# EAGLE design NextOne (EAGLE 7.3.0)
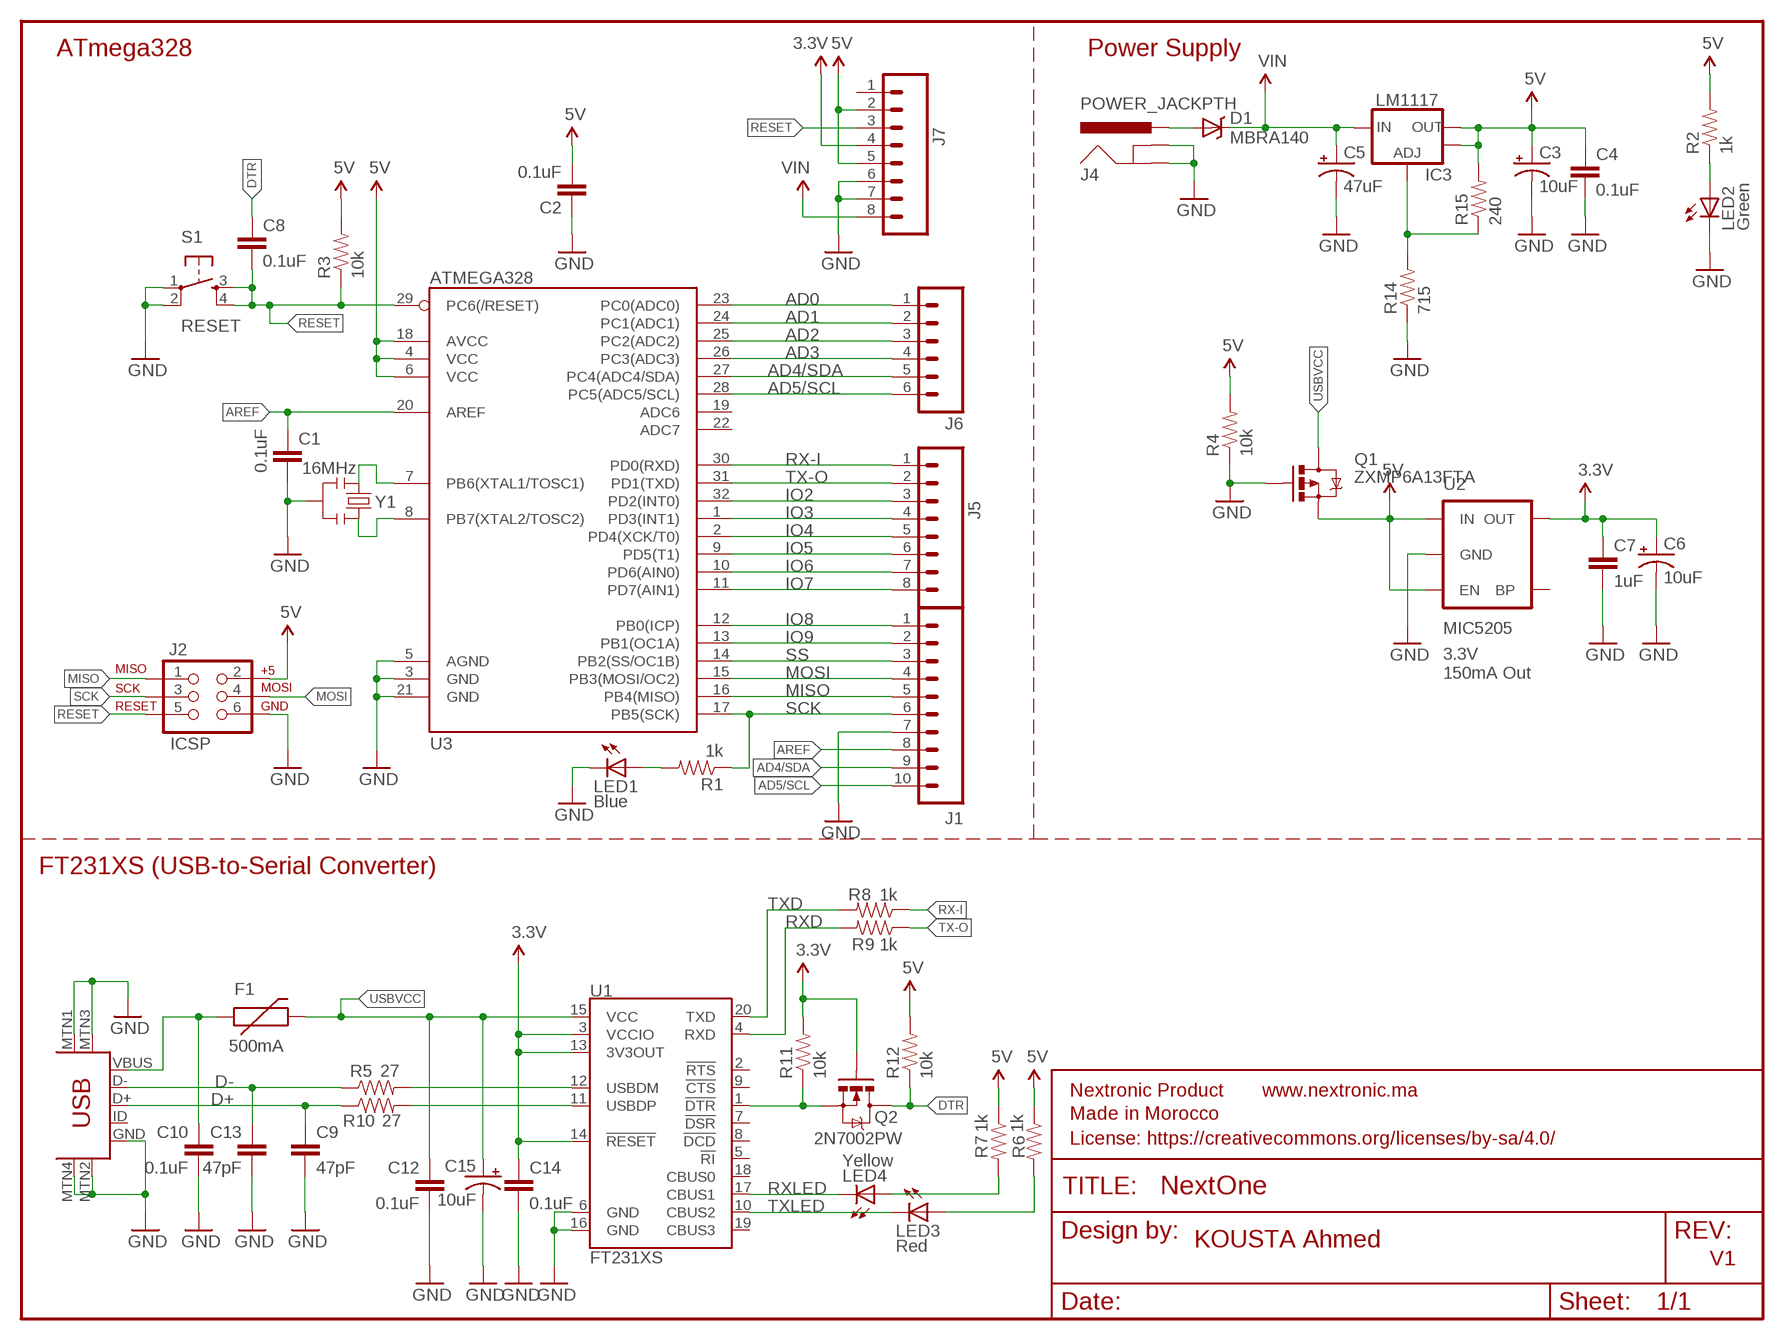
[diagram p0: schematic, sheet 1]

## Parts
C1  0.1uF  CAP0603-CAP  [0603-CAP]
C2  0.1uF  CAP0603-CAP  [0603-CAP]
C3  10uF  CAP_POL1206  [EIA3216]
C4  0.1uF  CAP0603-CAP  [0603-CAP]
C5  47uF  CAP_POLD  [PANASONIC_D]
C6  10uF  CAP_POL1206  [EIA3216]
C7  1uF  CAP0603-CAP  [0603-CAP]
C8  0.1uF  CAP0603-CAP  [0603-CAP]
C9  47pF  47PF-50V-5%(0603)  [0603-CAP]
C10  0.1uF  CAP0603-CAP  [0603-CAP]
C12  0.1uF  CAP0603-CAP  [0603-CAP]
C13  47pF  47PF-50V-5%(0603)  [0603-CAP]
C14  0.1uF  CAP0603-CAP  [0603-CAP]
C15  10uF  CAP_POL1206  [EIA3216]
D1  MBRA140  DIODE-SCHOTTKY_  [SMA-DIODE]
F1  500mA  PTCSMD  [PTC-1206]
FRAME1  FRAME-LETTER  [CREATIVE_COMMONS]
IC3  LM1117  V_REG_LM1117ALT1  [SOT223-ALT1]
J1  M10SILK_FEMALE_PTH  [1X10]
J2  ICSP  AVR_SPI_PRG_6PTH  [2X3]
J4  POWER_JACKPTH  [POWER_JACK_PTH]
J5  M08  [1X08_ROUND]
J6  M06SILK_FEMALE_PTH  [1X06]
J7  M08  [1X08_ROUND]
LED1  Blue  LED1206-NS  [LED-1206-NO_SILK]
LED2  Green  LED1206-NS  [LED-1206-NO_SILK]
LED3  Red  LED1206-NS  [LED-1206-NO_SILK]
LED4  Yellow  LED1206-NS  [LED-1206-NO_SILK]
Q1  ZXMP6A13FTA  MOSFET-PCHANNELSMD  [SOT23-3]
Q2  2N7002PW  MOSFET-NCHANNEL2N7002PW  [SOT323]
R1  1k  RESISTOR0603-RES  [0603-RES]
R2  1k  RESISTOR0603-RES  [0603-RES]
R3  10k  RESISTOR0603-RES  [0603-RES]
R4  10k  RESISTOR0603-RES  [0603-RES]
R5  27  RESISTOR0603-RES  [0603-RES]
R6  1k  RESISTOR0603-RES  [0603-RES]
R7  1k  RESISTOR0603-RES  [0603-RES]
R8  1k  RESISTOR0603-RES  [0603-RES]
R9  1k  RESISTOR0603-RES  [0603-RES]
R10  27  RESISTOR0603-RES  [0603-RES]
R11  10k  RESISTOR0603-RES  [0603-RES]
R12  10k  RESISTOR0603-RES  [0603-RES]
R14  715  RESISTOR0603-RES  [0603-RES]
R15  240  RESISTOR0603-RES  [0603-RES]
S1  RESET  TAC_SWITCHSMD  [TACTILE_SWITCH_SMD]
U1  FT231XS  [SSOP20_L]
U2  MIC5205  V_REG_LDOSMD  [SOT23-5]
U3  ATMEGA328  ATMEGA168  [TQFP32-08]
U$13  USB-MINIB-5PIN  [USB-MINIB]
Y1  16MHz  RESONATORSMD  [RESONATOR-SMD]

## Nets
3.3V: C6.A(+) C7.1 C14.1 J7.4 Q2.1(G) R11.2 U1.3(VCCIO) U1.13(3V3OUT) U1.14(!RESET) U2.5(OUT)
5V: C2.2 C3.A(+) C4.1 IC3.2(OUT) IC3.4(OUT) J2.2 J7.2 J7.5 Q1.2(S) R2.2 R3.2 R4.2 R6.1 R7.1 R12.2 R15.2 U2.1(IN) U2.3(EN) U3.4(VCC) U3.6(VCC) U3.18(AVCC)
AD0: J6.1 U3.23(PC0(ADC0))
AD1: J6.2 U3.24(PC1(ADC1))
AD2: J6.3 U3.25(PC2(ADC2))
AD3: J6.4 U3.26(PC3(ADC3))
AD4/SDA: J1.9 J6.5 U3.27(PC4(ADC4/SDA))
AD5/SCL: J1.10 J6.6 U3.28(PC5(ADC5/SCL))
AREF: C1.1 J1.8 U3.20(AREF)
D+: C9.1 R10.1 U$13.D+
D-: C13.1 R5.1 U$13.D-
DTR: C8.1 Q2.3(D) R12.1
GND: C1.2 C2.1 C3.C(-) C4.2 C5.- C6.C(-) C7.2 C9.2 C10.2 C12.2 C13.2 C14.2 C15.C(-) J1.7 J2.6 J4.GND J4.GNDBREAK J7.6 J7.7 LED1.C LED2.C Q1.1(G) R4.1 R14.1 S1.1 S1.2 U1.6(GND) U1.16(GND) U2.2(GND) U3.3(GND) U3.5(AGND) U3.21(GND) U$13.GND U$13.MTN1(MTN2) U$13.MTN2(MTN3) U$13.MTN3(MTN1) U$13.MTN4 Y1.2
IO2: J5.3 U3.32(PD2(INT0))
IO3: J5.4 U3.1(PD3(INT1))
IO4: J5.5 U3.2(PD4(XCK/T0))
IO5: J5.6 U3.9(PD5(T1))
IO6: J5.7 U3.10(PD6(AIN0))
IO7: J5.8 U3.11(PD7(AIN1))
IO8: J1.1 U3.12(PB0(ICP))
IO9: J1.2 U3.13(PB1(OC1A))
MISO: J1.5 J2.1 U3.16(PB4(MISO))
MOSI: J1.4 J2.4 U3.15(PB3(MOSI/OC2))
N$1: LED1.A R1.2
N$2: LED2.A R2.1
N$3: U3.7(PB6(XTAL1/TOSC1)) Y1.1
N$4: U3.8(PB7(XTAL2/TOSC2)) Y1.3
N$5: D1.A J4.PWR
N$6: R5.2 U1.12(USBDM)
N$7: R10.2 U1.11(USBDP)
N$8: LED3.A R6.2
N$10: LED4.A R7.2
N$12: Q2.2(S) R11.1 U1.1(!DTR)
N$15: IC3.1(ADJ) R14.2 R15.1
RESET: C8.2 J2.5 J7.3 R3.1 S1.3 S1.4 U3.29(PC6(/RESET))
RX-I: J5.1 R8.1 U3.30(PD0(RXD))
RXD: R9.2 U1.4(RXD)
RXLED: LED4.C U1.17(CBUS1)
SCK: J1.6 J2.3 R1.1 U3.17(PB5(SCK))
SS: J1.3 U3.14(PB2(SS/OC1B))
TX-O: J5.2 R9.1 U3.31(PD1(TXD))
TXD: R8.2 U1.20(TXD)
TXLED: LED3.C U1.10(CBUS2)
USBVCC: C12.1 C15.A(+) F1.2 Q1.3(D) U1.15(VCC)
VIN: C5.+ D1.C IC3.3(IN) J7.8
VUSB: C10.1 F1.1 U$13.VBUS
Unconnected: J7.1 U1.2(!RTS) U1.5(!RI) U1.7(!DSR) U1.8(!DCD) U1.9(!CTS) U1.18(CBUS0) U1.19(CBUS3) U2.4(BP) U3.19(ADC6) U3.22(ADC7) U$13.ID

## Notes on the sheet
- ATmega328 | Power Supply
- 3.3V
  150mA Out
- FT231XS (USB-to-Serial Converter)
- KOUSTA Ahmed
- V1

## Library data of the parts
C1 C2 C4 C8 C10 C12 C14 = SparkFun:CAP: Capacitor Standard 0603 ceramic capacitor, and 0.1" leaded capacitor.; OC_FARNELL: unknown
C3 C6 = SparkFun:CAP_POL: Capacitor Polarized These are standard SMD and PTH capacitors. Normally 10uF, 47uF, and 100uF in electrolytic and tantalum varieties. Always verify the external diameter of the through hole cap, it varies with capacity, voltage, and manufacturer. The EIA devices should be standard.; OC_FARNELL: unknown
C5 = SparkFun:CAP_POL: Capacitor Polarized These are standard SMD and PTH capacitors. Normally 10uF, 47uF, and 100uF in electrolytic and tantalum varieties. Always verify the external diameter of the through hole cap, it varies with capacity, voltage, and manufacturer. The EIA devices should be standard.; MF: PANASONIC ELECTRONIC COMPONENTS; MPN: EEE1CA470SP; OC_FARNELL: 9696946
C7 = SparkFun:CAP: Capacitor Standard 0603 ceramic capacitor, and 0.1" leaded capacitor.; MF: WALSIN; MPN: 0805B104K500CT; OC_FARNELL: 2496944
C9 C13 = SparkFun-Capacitors:47PF-50V-5%(0603): CAP-08913; MF: AVX; MPN: 12061A470JAT2A; OC_FARNELL: 499262; PROD_ID: CAP-08913
C15 = SparkFun-Capacitors:CAP_POL: Capacitor Polarized These are standard SMD and PTH capacitors. Normally 10uF, 47uF, and 100uF in electrolytic and tantalum varieties. Always verify the external diameter of the through hole cap, it varies with capacity, voltage, and manufacturer. The EIA devices should be standard.; OC_FARNELL: unknown
D1 = SparkFun:DIODE-SCHOTTKY; MF: DIODES INC.; MPN: B140-13-F; OC_FARNELL: 1843670
F1 = SparkFun:PTC: Resettable Fuse PTC Resettable Fuse. Spark Fun Electronics SKU : COM-08357; MF: FAIRCHILD SEMICONDUCTOR; MPN: 1N3070TR; OC_FARNELL: 1700871
FRAME1 = SparkFun-Aesthetics:FRAME-LETTER: Schematic Frame Standard 8.5x11 US Letter frame; OC_FARNELL: unknown
IC3 = Testing:V_REG_LM1117: Voltage Regulator LM1117 Standard adjustable voltage regulator but in SMD form. Spark Fun Electronics SKU : COM-00595; MF: STMICROELECTRONICS; MPN: LD1117S33TR; OC_FARNELL: 1202826
J1 = SparkFun-Connectors:M10: Header 10 Standard 10-pin 0.1" header. Use with straight break away headers (SKU : PRT-00116), right angle break away headers (PRT-00553), swiss pins (PRT-00743), machine pins (PRT-00117), and female headers (PRT-00115).; OC_FARNELL: unknown; PROD_ID: CONN-11563
J2 = SparkFun-Connectors:AVR_SPI_PRG_6: AVR ISP 6 Pin This is the reduced ISP connector for AVR programming. Common on Arduino. This footprint will take up less PCB space and can be used with a 10-pin to 6-pin adapter such as SKU: BOB-08508 **Special note about "TEST_POINT" package. The stop mask is on the top side, so if you want your programming test points to be on the bottom of your board, make sure to place this package on the bottom side of the board. This also ensure that the orientation to program from the bottom side will be correct.; OC_FARNELL: unknown
J4 = SparkFun-Connectors:POWER_JACK: Power Jack This is the standard 5.5mm barrel jack for power. The PTH is the most common, proven, reliable, footprint. The Slot footprint only works if the mill layer is transmitted to the PCB fab house so be warned. Mating wall wart : TOL-00298 (and others); OC_FARNELL: unknown; PROD_ID: CONN-08197
J5 J7 = SparkFun-Connectors:M08: Header 8 Standard 8-pin 0.1" header. Use with straight break away headers (SKU : PRT-00116), right angle break away headers (PRT-00553), swiss pins (PRT-00743), machine pins (PRT-00117), and female headers (PRT-00115).; OC_FARNELL: unknown; PROD_ID: CONN-08437
J6 = SparkFun-Connectors:M06: Header 6 Standard 6-pin 0.1" header. Use with straight break away headers (SKU : PRT-00116), right angle break away headers (PRT-00553), swiss pins (PRT-00743), machine pins (PRT-00117), and female headers (PRT-00115). Molex polarized connector foot print use with SKU : PRT-08094 with associated crimp pins and housings. NOTES ON THE VARIANTS LOCK and LOCK_LONGPADS... This footprint was designed to help hold the alignment of a through-hole component (i.e. 6-pin header) while soldering it into place. You may notice that each hole has been shifted either up or down by 0.005 of an inch from it's more standard position (which is a perfectly straight line). This slight alteration caused the pins (the squares in the middle) to touch the edges of the holes. Because they are alternating, it causes a "brace" to hold the component in place. 0.005 has proven to be the perfect amount of "off-center" position when using our standard breakaway headers. Although looks a little odd when you look at the bare footprint, once you have a header in there, the alteration is very hard to notice. Also,if you push a header all the way into place, it is covered up entirely on the bottom side. This idea of altering the position of holes to aid alignment will be further integrated into the Sparkfun Library for other footprints. It can help hold any component with 3 or more connection pins.; OC_FARNELL: unknown; PROD_ID: CONN-08437
LED1-LED4 = SparkFun-LED:LED: LEDs Standard schematic elements and footprints for 5mm, 3mm, 1206, and 0603 sized LEDs. 5mm - Spark Fun Electronics SKU : COM-00529 (and others); OC_FARNELL: unknown
Q1 = SparkFun:MOSFET-PCHANNEL; MF: DIODES INC.; MPN: ZXMP6A13FTA; OC_FARNELL: 1843770RL
Q2 = SparkFun-DiscreteSemi:MOSFET-NCHANNEL: Common NMOSFET Parts MFG P/N Store ID Prod ID FDD8780 TRANS-09984 SI7820DN TRANS-11055 FDS6630A IC-08089 2N7002PW TRANS-11151 FQP30N06L COM-10213 TRANS-10060 BSS123LT1G TRANS-08345 BSS138 TRANS-00830 BS170 2N7000; OC_FARNELL: unknown; PROD_ID: TRANS-11151
R1-R4 R6-R9 R11 R12 R14 R15 = SparkFun:RESISTOR: Resistor Basic schematic elements and footprints for 0603, 1206, and PTH resistors.; OC_FARNELL: unknown
R5 R10 = SparkFun-Resistors:RESISTOR: Resistor Basic schematic elements and footprints for 0603, 1206, and PTH resistors.; OC_FARNELL: unknown
S1 = SparkFun:TAC_SWITCH: Momentary Switch Button commonly used for reset or general input. Spark Fun Electronics SKU : COM-00097; OC_FARNELL: unknown
U1 = SparkFun-DigitalIC:FT231X: FTDI FT231X Full Speed USB to Full-handshake UART This USB2.0 Full Speed IC offers a compact bridge to full handshake UART interfaces. The device is a UART, capable of operating up to 3MBaud, with low power consumption (8mA). The FT231X includes the complete FT-X series feature set and enables USB to be added into a system design quickly and easily over a UART interface.; MF: FTDI; MPN: FT231XS; OC_FARNELL: 2081328
U2 = SparkFun:V_REG_LDO: Voltage Regulator LDO Standard 150mA LDO voltage regulator in SOT-23 layout. Micrel part MIC5205. BP (by-pass) pin is used to lower output noise with 470pF cap.; OC_FARNELL: unknown
U3 = SparkFun:ATMEGA168; MF: ATMEL; MPN: ATMEGA328P-AN; OC_FARNELL: 2443178
U$13 = SparkFun-Connectors:USB-MINIB: Mini-USB "B" connector with 5th pin broken out. Created new symbol breaking out 5th "ID" pin in mini/micro USB connector spec. See: http://en.wikipedia.org/wiki/Mini_usb#Cables. Uses same footprint as 4-pin symbol. Also added pins to connect to mounting / shield pads if required (probably not generally needed as signals aren't shielded once they leave the connector).; MF: TE CONNECTIVITY / AMP; MPN: 1734035-1.; OC_FARNELL: 1654060
Y1 = SparkFun-FreqCtrl:RESONATOR: Resonator Small SMD resonator. This is the itty bitty 10/20MHz resonators with built in caps. CSTCE10M0G55 and CSTCE20M0V53. Footprint has been reviewed closely but hasn't been tested yet.; OC_FARNELL: unknown

## Net classes
0 default: width 0.152 mm, drill 0.305 mm, clearance 0.152 mm

## Board
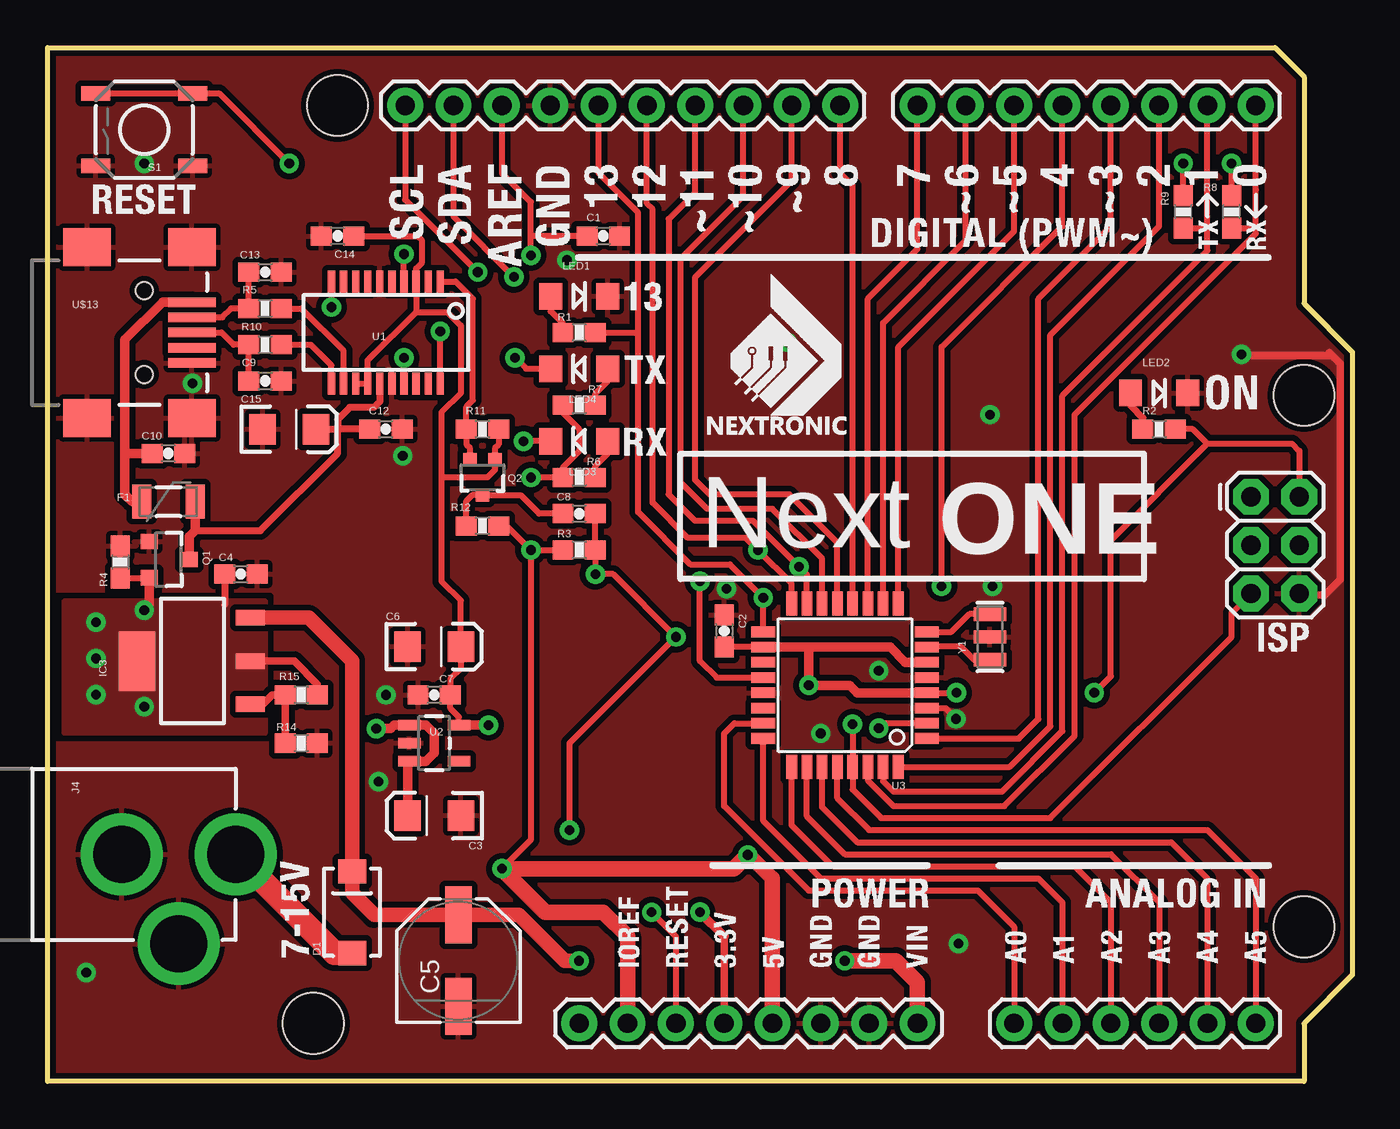
[diagram p1: board, top side]
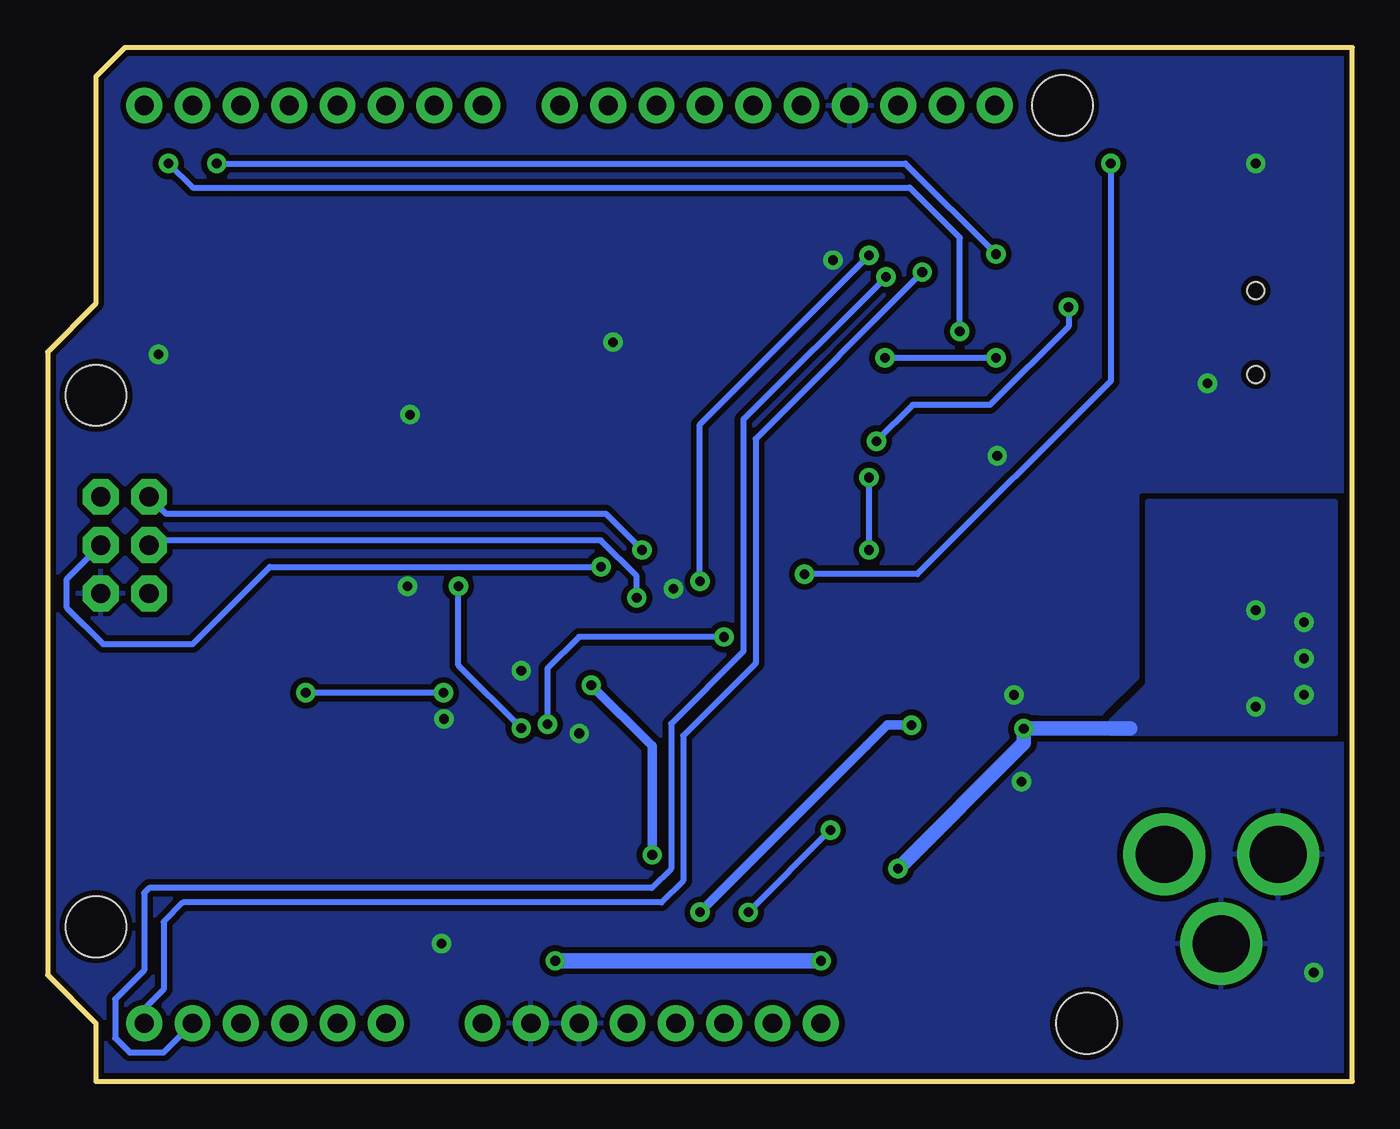
[diagram p2: board, bottom side, seen from below]

Size 68.58 x 54.36 mm. Coordinates in mm from the lower left corner, seen from the top.
Outline: 0,54.36 64.52,54.36 66.04,52.83 66.04,40.89 68.58,38.35 68.58,5.59 66.04,3.05 66.04,0 0,0 0,54.36
Copper layers (1*16): Top 0.035mm / dielectric 1.5mm / Bottom 0.035mm
Design rules "SparkFun-2-layer": minimum track width 7mil, minimum drill 15mil, track to track 8mil, track to pad 8mil, pad to pad 8mil, via to via 8mil, smd to smd 8mil, copper to edge 8mil, drill to drill 8mil, minimum pad ring 12mil, minimum via ring 10mil, stop-mask expansion 4mil, vias tented up to drill 20mil, thermal gap 10mil
Holes 3.2 mm at 13.97,3.05 66.04,8.13 66.04,36.07 15.24,51.31
vRestrict: area 0.6,22.4 to 2,30.6; area 5.7,23.1 to 7.4,30.6; area 47.9,10.8 to 48.5,11.3; area 50.4,10.7 to 50.9,11.6; area 11.3,29.3 to 12.7,31.6; area 0.3,13 to 9.4,25

### Footprints (pad centres in the part's own frame; a part is rotated, then mirrored left to right if it is on the bottom)
0603-CAP = smd 1.1 x 1: 1 -0.85,0; 2 0.85,0
EIA3216 = smd 1.4 x 1.6: A 1.4,0; C -1.4,0
PANASONIC_D = smd 3 x 1.4: + 2.4,0; - -2.4,0
SMA-DIODE = smd 1.27 x 1.47: A -2.15,0; C 2.15,0
PTC-1206 = smd 1 x 1.8: 1 -1.4,0; 2 1.4,0
SOT223-ALT1 = smd 0.813 x 1.524: 1 -2.271,-3.02; 2 0,-3.02; 3 2.288,-3.02 | smd 3.124 x 1.905: 4 0,2.921
1X10 = drill 1.016 pad 1.88: 1 0,0; 2 2.54,0; 3 5.08,0; 4 7.62,0; 5 10.16,0; 6 12.7,0; 7 15.24,0; 8 17.78,0; 9 20.32,0; 10 22.86,0
2X3 = drill 1.016 pad 1.88 octagon: 1 0,0; 2 0,2.54; 3 2.54,0; 4 2.54,2.54; 5 5.08,0; 6 5.08,2.54
POWER_JACK_PTH = drill 2.997 pad 4.318: GND 0,7.7; GNDBREAK 4.7,10.7; PWR 0,13.7
1X08_ROUND = drill 1.016 pad 1.88: 1 0,0; 2 2.54,0; 3 5.08,0; 4 7.62,0; 5 10.16,0; 6 12.7,0; 7 15.24,0; 8 17.78,0
1X06 = drill 1.016 pad 1.88: 1 0,0; 2 2.54,0; 3 5.08,0; 4 7.62,0; 5 10.16,0; 6 12.7,0
LED-1206-NO_SILK = smd 1.2 x 1.4: A -1.5,0; C 1.5,0
SOT23-3 = smd 0.8 x 0.9: 1 -0.95,-1; 2 0.95,-1; 3 0,1.1
SOT323 = smd 0.7 x 0.7: 1 -0.65,-0.925; 2 0.65,-0.925; 3 0,0.925
0603-RES = smd 1.1 x 1: 1 -0.85,0; 2 0.85,0
TACTILE_SWITCH_SMD = smd 1.524 x 0.762: 1 -2.54,1.905; 2 2.54,1.905; 3 -2.54,-1.905; 4 2.54,-1.905
SSOP20_L = smd 0.381 x 1.143: 1 -2.857,-2.68; 2 -2.223,-2.68; 3 -1.587,-2.68; 4 -0.953,-2.68; 5 -0.318,-2.68; 6 0.318,-2.68; 7 0.953,-2.68; 8 1.587,-2.68; 9 2.223,-2.68; 10 2.857,-2.68; 11 2.857,2.68; 12 2.223,2.68; 13 1.587,2.68; 14 0.953,2.68; 15 0.318,2.68; 16 -0.318,2.68; 17 -0.953,2.68; 18 -1.587,2.68; 19 -2.223,2.68; 20 -2.857,2.68
SOT23-5 = smd 0.55 x 1.2: 1 -0.95,-1.3; 2 0,-1.3; 3 0.95,-1.3; 4 0.95,1.3; 5 -0.95,1.3
TQFP32-08 = smd 1.27 x 0.559: 1 -4.293,2.8; 2 -4.293,2; 3 -4.293,1.2; 4 -4.293,0.4; 5 -4.293,-0.4; 6 -4.293,-1.2; 7 -4.293,-2; 8 -4.293,-2.8; 17 4.293,-2.8; 18 4.293,-2; 19 4.293,-1.2; 20 4.293,-0.4; 21 4.293,0.4; 22 4.293,1.2; 23 4.293,2; 24 4.293,2.8 | smd 0.559 x 1.27: 9 -2.8,-4.293; 10 -2,-4.293; 11 -1.2,-4.293; 12 -0.4,-4.293; 13 0.4,-4.293; 14 1.2,-4.293; 15 2,-4.293; 16 2.8,-4.293; 25 2.8,4.293; 26 2,4.293; 27 1.2,4.293; 28 0.4,4.293; 29 -0.4,4.293; 30 -1.2,4.293; 31 -2,4.293; 32 -2.8,4.293
USB-MINIB = smd 2.5 x 0.5: D+ 2.5,0; D- 2.5,0.8; GND 2.5,-1.6; ID 2.5,-0.8; VBUS 2.5,1.6 | smd 2.5 x 2: MTN1 -3,4.5; MTN2 2.5,4.5; MTN3 -3,-4.5; MTN4 2.5,-4.5 | hole 0.9: 0,2.2; 0,-2.2
RESONATOR-SMD = smd 0.7 x 1.7: 1 -1.2,0; 2 0,0; 3 1.2,0

### Placement (x,y rotation side)
C1  29.21,44.45 0 top
C2  35.56,23.68 270 top
C3  20.32,13.97 180 top
C4  10.16,26.67 0 top
C5  21.59,6.35 90 top
C6  20.32,22.86 0 top
C7  20.32,20.32 180 top
C8  27.94,29.84 0 top
C9  11.43,36.83 0 top
C10  6.35,33.02 0 top
C12  17.78,34.29 0 top
C13  11.43,42.55 0 top
C14  15.24,44.45 180 top
C15  12.7,34.29 0 top
D1  16,8.89 90 top
F1  6.35,30.48 0 top
FRAME1  -0.81,-0.94 0 top
IC3  7.62,22.1 90 top
J1  41.66,51.31 180 top
J2  63.25,30.73 270 top
J4  -3.81,11.94 270 top
J5  63.5,51.31 180 top
J6  50.8,3.05 0 top
J7  27.94,3.05 0 top
LED1  27.94,41.27 0 top
LED2  58.42,36.2 0 top
LED3  27.94,33.66 180 top
LED4  27.94,37.46 180 top
Q1  6.35,27.43 270 top
Q2  22.86,31.75 180 top
R1  27.94,39.37 180 top
R2  58.42,34.29 0 top
R3  27.94,27.94 180 top
R4  3.81,27.3 270 top
R5  11.43,40.64 0 top
R6  27.94,31.75 0 top
R7  27.94,35.56 0 top
R8  62.23,45.72 90 top
R9  59.69,45.72 90 top
R10  11.43,38.73 0 top
R11  22.86,34.29 0 top
R12  22.86,29.21 0 top
R14  13.33,17.78 180 top
R15  13.33,20.32 0 top
S1  5.08,50.04 180 top
U1  17.78,39.37 180 top
U2  20.32,17.78 270 top
U3  41.91,20.83 180 top
U$13  5.08,39.37 0 top
Y1  49.53,23.37 90 top

### Tracks (layer width: path | path; a pad name or v marks a point on that pad's centre or on a via)
3.3V  (via drill 0.51)
  Top 0.305: U2.5 21.62,19.15 21.17,19.6 C7.1 21.17,21.17 21.72,21.72 C6.A 21.72,25.27 20.7,26.29 20.7,31.75 | R11.2 23.71,33.49 23.51,33.29 Q2.1 23.51,32.15 23.11,31.75 20.7,31.75 | 19.37,40.45 U1.3 19.37,42.74 19.69,43.05 19.69,44.2 19.43,44.45 C14.1 | U1.13 U1.14 16.83,37.91 19.37,40.45 | 19.37,40.45 21.02,40.45 21.72,39.75 21.72,36.2 20.7,35.18 20.7,31.75
  Top 0.406: 35.56,7.62 J7.4
  Top 0.508: U2.5 v23.18,18.73 | v34.29,8.89 35.56,7.62
  Bottom 0.508: v34.29,8.89 25.53,17.65 25.52,17.65 24.45,18.73 v23.18,18.73
5V  (via drill 0.51)
  Top 0.305: U3.18 C2.2 | U3.4 v47.77,20.43 | 60.96,33.53 65.41,33.53 65.79,33.15 J2.2 | 60.96,33.53 55.88,28.45 55.88,21.3 v55.01,20.43 | 60.96,33.53 60.2,34.29 R2.2 | v25.4,27.94 25.4,12.7 v23.88,11.18 | v25.4,31.75 R6.1 27.09,32.3 27.94,33.15 27.94,34.29 27.09,35.14 R7.1 | v25.4,27.94 R3.2 | R4.2 5.32,26.46 Q1.2 | R12.2 24.13,29.21 v25.4,27.94
  Top 0.356: C4.1 9.31,25.06
  Top 0.406: IC3.2 12.95,22.1 14.19,20.87 R15.2 | C3.A 19.05,13.97
  Top 0.508: U3.6 45.09,22.03 44.29,22.83 40.01,22.83 | 40.01,22.83 U3.18 | 40.01,22.83 v40.01,20.83 42.16,20.83 42.56,20.43 U3.4 | C3.A 18.92,16.73 U2.3 19.88,16.83 20.32,17.27 20.32,18.29 19.88,18.73 U2.1 18.22,18.73 18.03,18.54 v17.27,18.54 | Q1.2 5.35,25.05 v5.08,24.78
  Top 0.762: v36.8,11.91 36.8,11.97 38.1,10.67
  Top 0.813: v36.8,11.91 36.07,11.18 v23.88,11.18 26.16,8.89 29.21,8.89 30.48,7.62 J7.2 | 38.1,10.67 J7.5
  Bottom 0.305: v47.77,20.43 v55.01,20.43 | v25.4,27.94 v25.4,31.75
  Bottom 0.508: v36.8,11.91 36.8,17.62 v40.01,20.83
  Bottom 0.762: v17.27,18.54 11.68,18.54 | 16.51,18.54 v17.27,18.54 | v23.88,11.18 17.27,17.78 v17.27,18.54
  other vias: 2.54,22.24 5.08,19.7 2.54,20.33 2.54,24.14
  pour Bottom (isolate 0.305, no thermals): 0.89,30.48 10.79,30.48 10.79,20.83 12.7,18.92 12.7,18.29 0.89,18.29
  pour Top (isolate 0.305, no thermals): 0.89,18.29 0.89,25.27 11.43,25.27 11.43,18.29
AD0
  Top 0.305: U3.23 36.1,18.83 35.56,18.29 35.56,14.48 40.01,10.03 48.9,10.03 50.8,8.13 J6.1
AD1
  Top 0.305: U3.24 37.62,13.69 40.64,10.67 52.07,10.67 53.34,9.4 J6.2
AD2
  Top 0.305: U3.25 39.11,13.47 41.28,11.3 53.98,11.3 55.88,9.4 J6.3
AD3
  Top 0.305: U3.26 39.91,13.94 41.91,11.94 55.88,11.94 58.42,9.4 J6.4
AD4/SDA  (via drill 0.51)
  Top 0.305: U3.27 40.71,14.41 42.55,12.57 59.06,12.57 60.96,10.67 J6.5 | v24.51,42.29 21.34,45.47 J1.9
  Bottom 0.305: v24.51,42.29 32,34.8 32,22.61 35.81,18.8 35.81,11.18 36.83,10.16 63.25,10.16 63.5,9.91 63.5,5.84 65.02,4.32 65.02,2.29 64.26,1.52 62.48,1.52 J6.5
AD5/SCL  (via drill 0.51)
  Top 0.305: U3.28 41.51,14.88 43.18,13.21 60.96,13.21 63.5,10.67 J6.6 | J1.10 18.8,46.36 v22.61,42.55
  Bottom 0.305: v22.61,42.55 31.37,33.78 31.37,21.97 35.18,18.16 35.18,10.54 36.32,9.4 61.47,9.4 62.48,8.38 62.48,4.83 63.5,3.81 J6.6
AREF  (via drill 0.51)
  Top 0.305: U3.20 35.16,21.23 34.29,22.1 v34.29,26.29 | J1.8 23.88,47.75 25.4,46.23 25.4,44.45 | v25.4,43.43 25.4,44.45 | C1.1 25.4,44.45
  Bottom 0.305: v25.4,43.43 34.29,34.54 v34.29,26.29
D+
  Top 0.305: R10.1 10.58,38.95 | U$13.D+ 9.14,39.37 9.78,38.74 R10.1 | C9.1 R10.1
D-
  Top 0.305: U$13.D- 9.18,40.17 9.65,40.64 R5.1 C13.1
DTR
  Top 0.305: R12.1 22.01,30.52 22.32,30.83 Q2.3 24.86,30.83 25.84,29.85 C8.1
GND  (via drill 0.5, 0.51)
  Top 0.305: U3.3 47.17,19.63 v47.75,19.05
  Top 0.406: v62.75,38.22 62.83,38.22 62.83,38.17 67.35,38.17 67.35,38.32 67.94,37.73 67.94,26.38 67.14,25.57 65.64,25.57 65.67,25.6 65.85,25.6
  other vias: 5.08,48.26 40.64,18.29 43.69,21.59 49.66,26.03 35.69,25.91 2.03,5.71 7.62,36.7 27.3,43.18 18.67,32.89 17.78,20.32 17.4,15.75 49.53,35.05 38.86,38.86 47.88,7.24
  pour Top (isolate 0.305, rank 2): 0,54.36 64.52,54.36 66.04,52.83 66.04,40.89 68.58,38.35 68.58,5.59 66.04,3.05 66.04,0 0,0
  pour Bottom (isolate 0.305, rank 2): 0,54.36 64.52,54.36 66.04,52.83 66.04,40.89 68.58,38.35 68.58,5.59 66.04,3.05 66.04,0 0,0
IO2
  Top 0.305: U3.32 50.57,16.54 52.71,18.67 52.71,39.24 58.42,44.96 J5.3
IO3
  Top 0.305: U3.1 51.05,18.03 52.07,19.05 52.07,41.15 55.88,44.96 J5.4
IO4  (via drill 0.51)
  Top 0.305: v46.99,26.04 46.99,38.61 53.34,44.96 J5.5 | U3.2 43.94,18.83 v43.69,18.57
  Bottom 0.305: v43.69,18.57 46.99,21.88 v46.99,26.04
IO5
  Top 0.305: U3.9 44.71,38.61 50.8,44.7 J5.6
IO6
  Top 0.305: U3.10 43.91,39.88 48.26,44.23 J5.7
IO7
  Top 0.305: U3.11 43.11,41.15 45.72,43.76 J5.8
IO8
  Top 0.305: U3.12 42.31,47.1 41.66,47.75 J1.1
IO9
  Top 0.305: J1.2 39.12,47.35 34.04,42.27 34.04,31.62 34.8,30.86 38.99,30.86 41.51,28.34 U3.13
MISO  (via drill 0.51)
  Top 0.305: U3.16 39.11,26.17 v37.34,27.94 36.7,28.58 33.66,28.58 31.8,30.43 31.8,45.85 31.5,46.15 J1.5
  Bottom 0.305: v37.34,27.94 39.24,29.85 62.36,29.85 J2.1
MOSI  (via drill 0.51)
  Top 0.305: U3.15 39.91,26.64 v39.5,27.05 37.08,29.46 34.04,29.46 32.64,30.86 32.64,45.34 34.04,46.74 J1.4
  Bottom 0.305: v39.5,27.05 56.9,27.05 60.96,22.99 65.66,22.99 67.56,24.89 67.56,26.42 J2.4
N$1
  Top 0.305: R1.2 27.09,39.84 26.44,40.49 LED1.A
N$2
  Top 0.356: R2.1 57.57,34.89 56.92,35.54 LED2.A
N$3
  Top 0.305: Y1.1 48.7,22.17 48.01,22.86 46.17,22.86 | 45.72,22.86 46.17,22.86 | 46.17,22.86 U3.7
N$4
  Top 0.305: U3.8 47.5,23.63 48.44,24.57 Y1.3
N$5
  Top 1.27: D1.A 15.09,6.74 J4.PWR
N$6
  Top 0.305: R5.2 13.34,40.64 15.56,38.42 U1.12
N$7
  Top 0.305: U1.11 14.92,37.66 13.84,38.74 R10.2
N$8
  Top 0.305: R6.2 28.79,32.35 29.44,33 LED3.A
N$10
  Top 0.305: LED4.A 29.44,36.81 28.79,36.16 R7.2
N$12
  Top 0.305: Q2.2 22.21,33.29 22.01,33.49 R11.1 22.01,35.47 22.35,35.81 22.35,41.15 21.45,42.05 U1.1
N$15
  Top 0.406: IC3.1 11.32,19.83 11.81,20.32 R15.1 R14.2
RESET  (via drill 0.5, 0.51)
  Top 0.305: v42.31,18.78 U3.29 42.31,15.35 43.82,13.84 52.71,13.84 62.23,23.37 62.23,24.64 J2.5 | S1.4 S1.3 9.02,51.94 v12.7,48.26 | C8.2 R3.1 v28.79,26.67 29.72,26.67 v33.02,23.37 27.43,17.78 v27.43,13.21 | v31.75,8.89 33.02,7.62 J7.3
  Bottom 0.305: v42.31,18.78 42.31,21.7 40.64,23.37 v33.02,23.37 | v12.7,48.26 12.7,36.83 22.86,26.67 v28.79,26.67 | v31.75,8.89 v27.43,13.21
RX-I
  Top 0.254: 63.5,46.86 63.52,46.88
  Top 0.305: 63.5,44.83 63.5,44.58 53.98,35.05 53.98,18.16 50.29,14.48 44.45,14.48 43.11,15.82 U3.30 | 63.5,44.83 63.5,46.86 J5.1 | R8.1 63.46,44.87 63.5,44.83
RXD  (via drill 0.51)
  Top 0.305: R9.2 v59.69,48.26 | U1.4 v18.73,43.5
  Bottom 0.305: v59.69,48.26 23.5,48.26 v18.73,43.5
RXLED  (via drill 0.51)
  Top 0.305: U1.17 v18.73,38.04 | v24.57,38.04 25.15,37.47 LED4.C
  Bottom 0.305: v18.73,38.04 v24.57,38.04
SCK  (via drill 0.51)
  Top 0.305: U3.17 v37.62,25.43 35.87,27.18 33.78,27.18 31.04,29.92 31.04,39.37 | R1.1 31.04,39.37 | 31.04,39.37 31.04,45.67 28.96,47.75 J1.6
  Bottom 0.305: v37.62,25.43 37.62,26.57 39.5,28.45 62.99,28.45 J2.3
SS
  Top 0.305: J1.3 36.58,46.55 33.27,43.25 33.27,31.5 34.67,30.1 38.1,30.1 40.71,27.49 U3.14
TX-O
  Top 0.254: 60.96,46.86 60.95,46.88
  Top 0.305: U3.31 43.91,15.78 44.45,15.24 50.17,15.24 53.34,18.42 53.34,36.07 60.96,43.69 60.96,44.83 | 60.96,44.83 60.96,46.86 J5.2 | R9.1 60.92,44.87 60.96,44.83
TXD  (via drill 0.51)
  Top 0.305: R8.2 v62.23,48.26 | U1.20 v20.64,39.43
  Bottom 0.305: v62.23,48.26 60.96,46.99 23.27,46.99 20.64,44.36 v20.64,39.43
TXLED  (via drill 0.51)
  Top 0.305: U1.10 v14.92,40.7 | LED3.C v25.02,33.66
  Bottom 0.305: v14.92,40.7 14.92,39.69 19.05,35.56 23.11,35.56 v25.02,33.66
USBVCC
  Top 0.356: C15.A 15.24,34.29 | U1.15 17.46,35.75 17.15,35.43 15.88,35.43 15.24,34.8 15.24,34.29 | C12.1 15.24,34.29 | 7.75,28.96 11.18,28.96 15.24,33.02 15.24,34.29
  Top 0.508: F1.2 7.75,28.96 7.45,28.66 Q1.3
VIN  (via drill 0.51)
  Top 0.762: v27.93,6.34 27.17,6.34 24.76,8.75 C5.+ 17.16,8.75 16,9.91 D1.C 16,22.1 13.72,24.39 IC3.3
  Top 0.813: v41.9,6.34 44.59,6.34 45.72,5.21 J7.8
  Bottom 0.813: v27.93,6.34 v41.9,6.34
VUSB
  Top 0.508: 4.06,33.02 4.06,38.99 6.05,40.97 U$13.VBUS | C10.1 4.06,33.02 | 4.06,33.02 4.06,30.86 4.45,30.48 F1.1

### Text on the board
tPlace: Next | ONE
214bmp: D:/SmartProjects/Snc/a4_bn_logo2.bmp